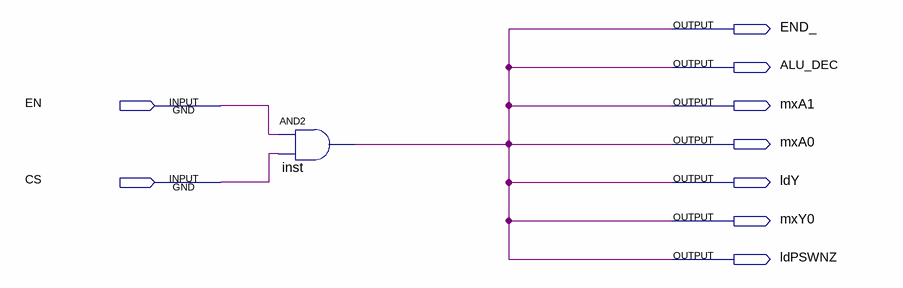
[diagram p0: schematic sheet]
// Quartus schematic DEY.bdf as structural Verilog: 1 symbols, 9 pins
module DEY (
  input  EN,
  input  CS,
  output END_,
  output ALU_DEC,
  output mxA1,
  output mxA0,
  output ldY,
  output mxY0,
  output ldPSWNZ
);

  and inst (ALU_DEC, EN, CS);

  assign END_ = ALU_DEC;
  assign ldPSWNZ = ALU_DEC;
  assign ldY = ALU_DEC;
  assign mxA0 = ALU_DEC;
  assign mxA1 = ALU_DEC;
  assign mxY0 = ALU_DEC;
endmodule
